# Altium schematic sheet Half_Bridge.SchDoc
size A3; Organization0: INDÚSTRIA DE MATERIAL BÉLICO DO BRASIL; Organization2: FÁBRICA DE MATERIAL DE; Organization3: COMUNICAÇÕES E ELETRÔNICA; Organization1: VINCULADA AO EXÉRCITO BRASILEIRO; USADOEQP: USADOEQP; Esquematico: Esquemático; CODIGO: Código; ESTOQUE: Estoque
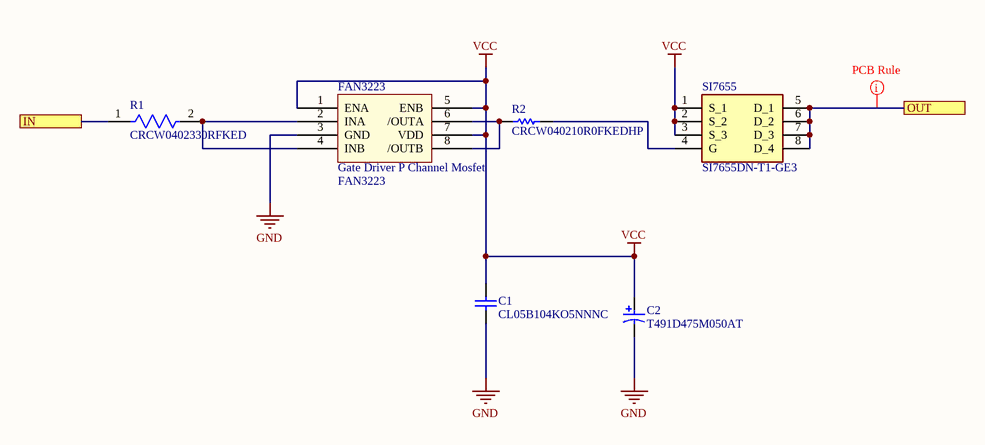
[diagram p0: Half_Bridge.SchDoc]

## Parts
C1  CL05B104KO5NNNC  [CAPC1050X55X23ML05T13]
C2  T491D475M050AT  [KEMT-T491-D_L]
FAN3223  Gate Driver P Channel Mosfet  value FAN3223  [FAN3223]
R1  CRCW0402330RFKED  [FP-CRCW0402-e3-MFG]
R2  CRCW040210R0FKEDHP  [RESC1005X40X25NL05T10]
SI7655  SI7655DN-T1-GE3  [SIS862DNT1GE3]

## Ports
IN, OUT

## Nets
GND: C1.1 C2.2 FAN3223.3(GND)
VCC: C1.2 C2.1 FAN3223.1(ENA) FAN3223.5(ENB) FAN3223.7(VDD) SI7655.1(S_1) SI7655.2(S_2) SI7655.3(S_3)
IN: R1.1 ; port IN
OUT: SI7655.5(D_1) SI7655.6(D_2) SI7655.7(D_3) SI7655.8(D_4) ; port OUT
NetFAN3223_2: FAN3223.2(INA) FAN3223.4(INB) R1.2
NetFAN3223_6: FAN3223.6(/OUTA) FAN3223.8(/OUTB) R2.1
NetR2_2: R2.2 SI7655.4(G)

## Layout directives
rule Polygon Connect Style [Style - Direct Connect]: OUT

## Notes on the sheet
- USADO EQUIP.:
- ENG:
- REV:
- TÍTULO:
- DATA:
- HORA:
- APROV._______
- CÓDIGO:
- ESTOQUE:
- FOLHA:
- /
- FORMATO:
- A3

## Library data of the parts
C1 = CMP-2000-05439-1: Chip Capacitor, 100 nF, +/- 10%, 16 V, -55 to 125 degC, 0402 (1005 Metric), RoHS, Tape and Reel; Manufacturer: Samsung Electro-Mechanics; Capacitance: 100000pF; Dielectric: X7R; Rated Voltage: 16V; Case Size/Dimension: 0402; Tolerance (%): ±10%; Manufacturer URL: http://www.samsungsem.com/global/index.jsp; Datasheet URL: https://datasheet.ciiva.com/29198/458718-da-01-en-vs-kondensator-0402-29198423.pdf; Datasheet Version: Nov-10
C2 = CMP-2000-07203-1: Tantalum Surface Mount Capacitor, 4.7 uF, +/- 20%, 50 V, -55 to 125 degC, 2-Pin SMD, RoHS, Tape and Reel; Manufacturer: Kemet; DF: 6%; Polarity: Polar; Voltage: 50VDC; Product Depth (mm): 4.3mm; Insulation: NotRequired; DCL: 2.4uA; Product Height (mm): 2.8mm; Rad Hardened: No; Capacitance: 4700000pF; Product Length (mm): 7.3mm; ESR: 1.4ohm; Case Style: Molded; Lead Spacing (nom): NotRequiredmm; Packaging: TapeandReel; Operating Temp Range: -55Cto125C; Mounting Style: SurfaceMount; Length W/Weld (max): NotRequiredmm; Package Reference: T491-D; Construction: SMTChip; Case Code: D; Package Description: 2-Pin Surface Mount Device, Body 7.3 x 4.3 mm; Seated Plane Height: NotRequiredmm; Wire Form: NotRequired; Mounting Technology: SurfaceMount; Manufacturer URL: http://www.kemet.com/; Seal: NotRequired; Tolerance (+ or -): 20%; Failure Rate: NotRequired; Datasheet Version: 06/2016; Length W/Weld: NotRequiredmm; Package / Case: 7343-31; Product Diameter (mm): NotRequiredmm; Datasheet URL: http://www.kemet.com/Lists/ProductCatalog/Attachments/254/KEM_T2005_T491.pdf
FAN3223 = FAN3223: ComponentLink1Description: New link; ComponentLink1URL: *
R1 = CMP-2002-08523-2: RES Thick Film, 330Ω, 1%, 0.063W, 100ppm/°C, 0402; Max Power Dissipation: 63mW; Voltage Rating (DC): 50V; Resistance: 330R; Case/Package: 0402; Packaging: Tape and Reel; Width: 0.5mm; Case Code (Metric): 1005; Radiation Hardening: No; Military Standard: Not; Contact Plating: Tin; Temperature Coefficient: 100ppm/°C; Lead Free: Lead Free; Power Rating: 63mW; Voltage Rating: 50V; Tolerance: 1%; Features: Automotive AEC-Q200; Case Code (Imperial): 0402; Composition: Thick Film; Weight: 2.3E-05oz; Package Quantity: 10; Min Operating Temperature: -55°C; Height: 0.35mm; Length: 1mm; Termination: SMD/SMT; Number of Terminations: 2; Depth: 0.5mm; Max Operating Temperature: 155°C
R2 = CMP-2002-03046-1: Manufacturer: Vishay Dale; Part Number: CRCW040210R0FKEDHP
SI7655 = SI7655DN-T1-GE3: MOSFET (P-Channel); Manufacturer_Name: Vishay; Datasheet Link: https://www.vishay.com/docs/63617/si7655dn.pdf; Manufacturer_Part_Number: SI7655DN-T1-GE3; Mouser Part Number: 78-SI7655DN-T1-GE3; Mouser Price/Stock: https://www.mouser.co.uk/ProductDetail/Vishay-Semiconductors/SI7655DN-T1-GE3?qs=8YL4b%2FT9KqrUzqvG%2FOmMqw%3D%3D; Arrow Part Number: SI7655DN-T1-GE3; Arrow Price/Stock: https://www.arrow.com/en/products/si7655dn-t1-ge3/vishay